# Altium schematic sheet [3] SCHEMATIC (new).SchDoc
size A3; SheetNumber: 1; SheetTotal: 1
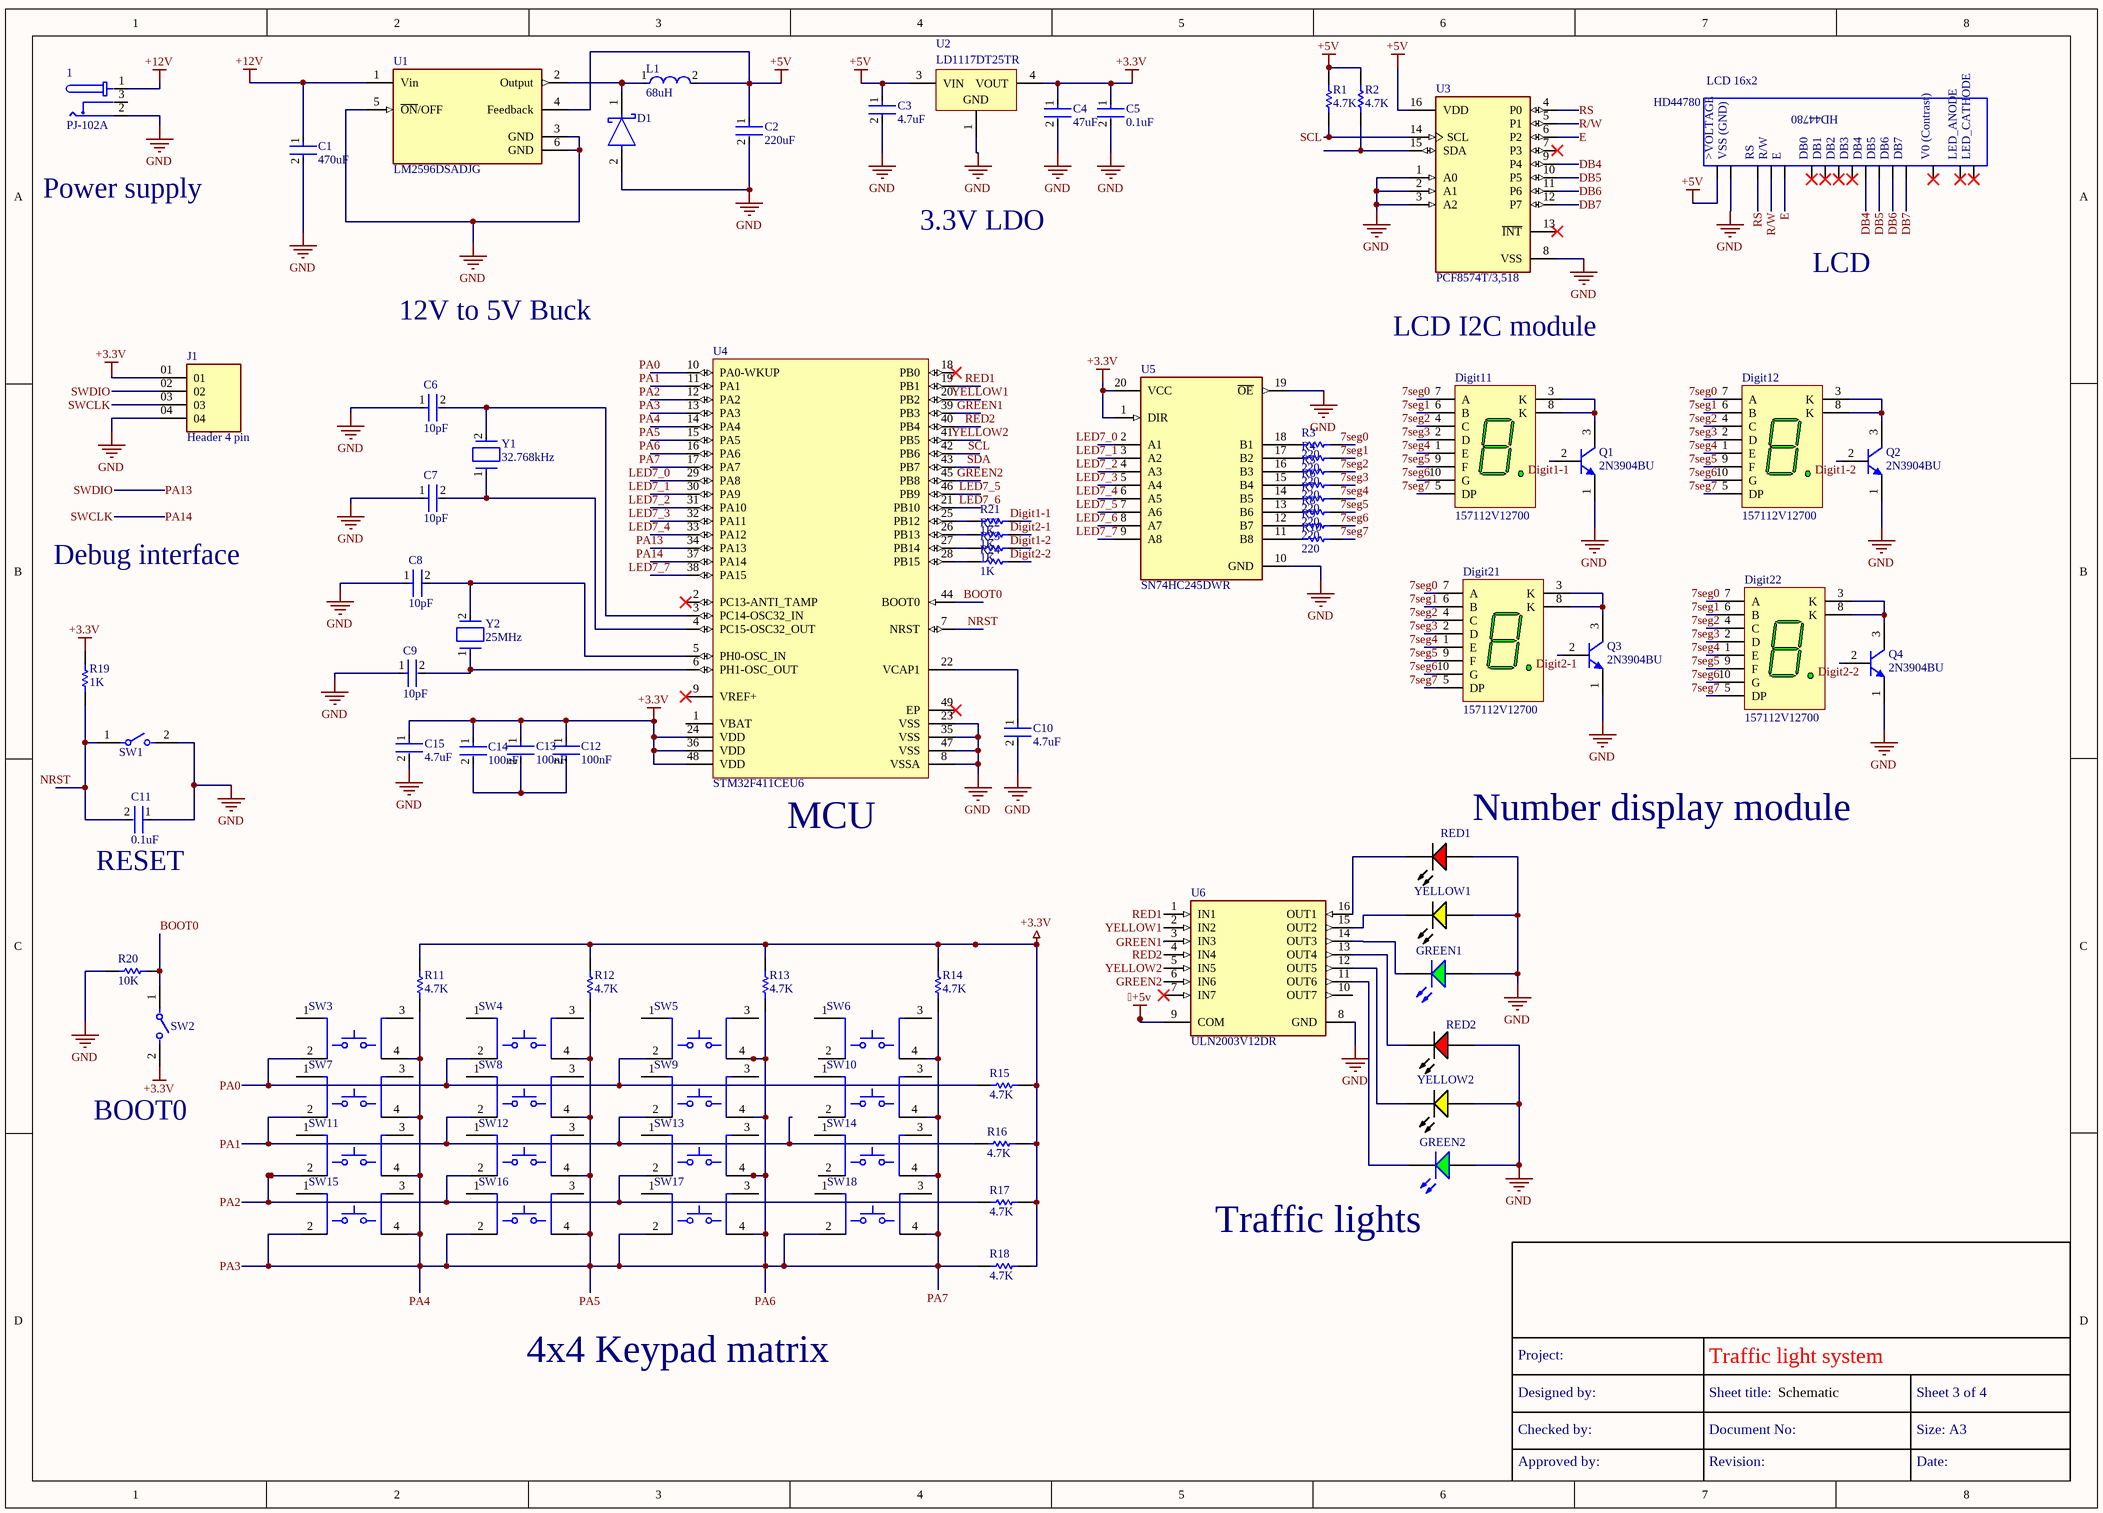
[diagram p0: [3] SCHEMATIC (new).SchDoc]

## Parts
1  PJ-102A  [CUI_PJ-102A]
C1  470uF  [FP-1206-L_3_2_0_2-W_1_6_0-IPC_A]
C2  220uF  [FP-CC1210-GD-IPC_C]
C3  4.7uF  [FP-1210-L_3_2_0_3-W_2_5_0-IPC_B]
C4  47uF  [FP-1206-L_3_2_0_2-W_1_6_0-IPC_A]
C5  0.1uF  [FP-C1206C-EB-MFG]
C6  10pF  [FP-C0603C-CF-IPC_B]
C7  10pF  [FP-C0603C-CF-IPC_B]
C8  10pF  [FP-C0603C-CF-IPC_B]
C9  10pF  [FP-C0603C-CF-IPC_B]
C10  4.7uF  [FP-1210-L_3_2_0_3-W_2_5_0-IPC_B]
C11  0.1uF  [FP-C1206C-EB-MFG]
C12  100nF  [FP-C1206C-EB-MFG]
C13  100nF  [FP-C1206C-EB-MFG]
C14  100nF  [FP-C1206C-EB-MFG]
C15  4.7uF  [FP-1210-L_3_2_0_3-W_2_5_0-IPC_B]
D1  1N5818-T  [FP-DO-41_Plastic-MFG]  (value not drawn)
Digit11  157112V12700  [WL-S7DS_L12W7.3H3.75]
Digit12  157112V12700  [WL-S7DS_L12W7.3H3.75]
Digit21  157112V12700  [WL-S7DS_L12W7.3H3.75]
Digit22  157112V12700  [WL-S7DS_L12W7.3H3.75]
GREEN1  WP7113SGD  [KING-WP7113SGD_V]  (value not drawn)
GREEN2  WP7113SGD  [KING-WP7113SGD_V]  (value not drawn)
J1  Header 4 pin  [SAMTEC_MTLW-104-X-X-S-X]
L1  68uH  [FP-LB2012-1_25-0_2-IPC_B]
LCD_16x2  HD44780  [16026-16X2]
Q1  2N3904BU  [FAIR-TO-92]
Q2  2N3904BU  [FAIR-TO-92]
Q3  2N3904BU  [FAIR-TO-92]
Q4  2N3904BU  [FAIR-TO-92]
R1  4.7K  [RESC1005X40X25NL05T05]
R2  4.7K  [RESC1005X40X25NL05T05]
R3  220  [RESC3225X60X45ML20T20]
R4  220  [RESC3225X60X45ML20T20]
R5  220  [RESC3225X60X45ML20T20]
R6  220  [RESC3225X60X45ML20T20]
R7  220  [RESC3225X60X45ML20T20]
R8  220  [RESC3225X60X45ML20T20]
R9  220  [RESC3225X60X45ML20T20]
R10  220  [RESC3225X60X45ML20T20]
R11  4.7K  [RESC1005X40X25NL05T05]
R12  4.7K  [RESC1005X40X25NL05T05]
R13  4.7K  [RESC1005X40X25NL05T05]
R14  4.7K  [RESC1005X40X25NL05T05]
R15  4.7K  [RESC1005X40X25NL05T05]
R16  4.7K  [RESC1005X40X25NL05T05]
R17  4.7K  [RESC1005X40X25NL05T05]
R18  4.7K  [RESC1005X40X25NL05T05]
R19  1K  [RESC0603X28X15ML05T05]
R20  10K  [RESC2013X60X30NL20T20]
R21  1K  [RESC0603X28X15ML05T05]
R22  1K  [RESC0603X28X15ML05T05]
R23  1K  [RESC0603X28X15ML05T05]
R24  1K  [RESC0603X28X15ML05T05]
RED1  WP7113SRD/D  [KING-WP7113SRDD_V]  (value not drawn)
RED2  WP7113SRD/D  [KING-WP7113SRDD_V]  (value not drawn)
SW1  CHS-01TA  [FP-CHS-01TA-MFG]  (value not drawn)
SW2  CHS-01TA  [FP-CHS-01TA-MFG]  (value not drawn)
SW3  SKQBARA010  [FP-SKQBARA010-MFG]  (value not drawn)
SW4  SKQBARA010  [FP-SKQBARA010-MFG]  (value not drawn)
SW5  SKQBARA010  [FP-SKQBARA010-MFG]  (value not drawn)
SW6  SKQBARA010  [FP-SKQBARA010-MFG]  (value not drawn)
SW7  SKQBARA010  [FP-SKQBARA010-MFG]  (value not drawn)
SW8  SKQBARA010  [FP-SKQBARA010-MFG]  (value not drawn)
SW9  SKQBARA010  [FP-SKQBARA010-MFG]  (value not drawn)
SW10  SKQBARA010  [FP-SKQBARA010-MFG]  (value not drawn)
SW11  SKQBARA010  [FP-SKQBARA010-MFG]  (value not drawn)
SW12  SKQBARA010  [FP-SKQBARA010-MFG]  (value not drawn)
SW13  SKQBARA010  [FP-SKQBARA010-MFG]  (value not drawn)
SW14  SKQBARA010  [FP-SKQBARA010-MFG]  (value not drawn)
SW15  SKQBARA010  [FP-SKQBARA010-MFG]  (value not drawn)
SW16  SKQBARA010  [FP-SKQBARA010-MFG]  (value not drawn)
SW17  SKQBARA010  [FP-SKQBARA010-MFG]  (value not drawn)
SW18  SKQBARA010  [FP-SKQBARA010-MFG]  (value not drawn)
U1  LM2596DSADJG  [FP-936A-02-MFG]
U2  LD1117DT25TR  [TO-252_L]
U3  PCF8574T/3,518  [FP-SOT162-1-MFG]
U4  STM32F411CEU6  [STM-UFQFPN48_L]
U5  SN74HC245DWR  [FP-DW0020A-MFG]
U6  ULN2003V12DR  [FP-D0016A-MFG]
Y1  32.768kHz  [FP-ABS09-MFG]
Y2  25MHz  [FP-7A-MFG]
YELLOW1  WP7113SYD  [KING-WP7113SYD_V]  (value not drawn)
YELLOW2  WP7113SYD  [KING-WP7113SYD_V]  (value not drawn)

## Nets
+5v: C4.1 C5.1 C12.1 C13.1 C14.1 C15.1 J1.01 R11.2 R12.2 R13.2 R14.2 R15.1 R16.1 R17.1 R18.1 R19.2 SW2.2 U2.4(VOUT) U4.24(VDD) U4.36(VDD) U4.48(VDD) U5.1(DIR) U5.20(VCC) U6.9(COM)  [also labelled +3.3V]
+5V: C2.1 C3.1 L1.2 LCD_16x2.P$2(VDD) R1.2 R2.2 U1.4(Feedback) U2.3(VIN) U3.16(VDD)
+12V: 1.1 C1.1 U1.1(Vin)
GND: 1.2 C1.2 C2.2 C3.2 C4.2 C5.2 C6.1 C7.1 C8.1 C9.1 C10.2 C11.1 C15.2 D1.2(A) GREEN1.1(A) GREEN2.1(A) J1.04 LCD_16x2.P$1(VSS) Q1.1(E) Q2.1(E) Q3.1(E) Q4.1(E) R20.1 RED1.1(A) RED2.1(A) SW1.2 U1.3(GND) U1.5(~{ON}/OFF) U1.6(GND) U2.1(GND) U3.1(A0) U3.2(A1) U3.3(A2) U3.8(VSS) U4.8(VSSA) U4.23(VSS) U4.35(VSS) U4.47(VSS) U5.10(GND) U5.19(~{OE}) U6.8(GND) YELLOW1.1(A) YELLOW2.1(A)
7seg0: Digit11.7(A) Digit12.7(A) Digit21.7(A) Digit22.7(A) R3.2
7seg1: Digit11.6(B) Digit12.6(B) Digit21.6(B) Digit22.6(B) R4.2
7seg2: Digit11.4(C) Digit12.4(C) Digit21.4(C) Digit22.4(C) R5.2
7seg3: Digit11.2(D) Digit12.2(D) Digit21.2(D) Digit22.2(D) R6.2
7seg4: Digit11.1(E) Digit12.1(E) Digit21.1(E) Digit22.1(E) R7.2
7seg5: Digit11.9(F) Digit12.9(F) Digit21.9(F) Digit22.9(F) R8.2
7seg6: Digit11.10(G) Digit12.10(G) Digit21.10(G) Digit22.10(G) R9.2
7seg7: Digit11.5(DP) Digit12.5(DP) Digit21.5(DP) Digit22.5(DP) R10.2
BOOT0: R20.2 SW2.1 U4.44(BOOT0)
DB4: LCD_16x2.P$11(DB4) U3.9(P4)
DB5: LCD_16x2.P$12(DB5) U3.10(P5)
DB6: LCD_16x2.P$13(DB6) U3.11(P6)
DB7: LCD_16x2.P$14(DB7) U3.12(P7)
Digit1-1: Q1.2(B) R21.2
Digit1-2: Q2.2(B) R23.2
Digit2-1: Q3.2(B) R22.2
Digit2-2: Q4.2(B) R24.2
E: LCD_16x2.P$6(E) U3.6(P2)
GREEN1: U4.39(PB3) U6.3(IN3)
GREEN2: U4.45(PB8) U6.6(IN6)
LED7_0: U4.29(PA8) U5.2(A1)
LED7_1: U4.30(PA9) U5.3(A2)
LED7_2: U4.31(PA10) U5.4(A3)
LED7_3: U4.32(PA11) U5.5(A4)
LED7_4: U4.33(PA12) U5.6(A5)
LED7_5: U4.46(PB9) U5.7(A6)
LED7_6: U4.21(PB10) U5.8(A7)
LED7_7: U4.38(PA15) U5.9(A8)
NRST: C11.2 R19.1 SW1.1 U4.7(NRST)
PA0: R15.2 SW3.2 SW4.2 SW5.2 U4.10(PA0-WKUP)
PA1: R16.2 SW7.2 SW8.2 SW9.2 U4.11(PA1)
PA2: R17.2 SW11.2 SW12.2 SW13.2 U4.12(PA2)
PA3: R11.1 R12.1 R13.1 R14.1 R18.2 SW3.4 SW4.4 SW5.4 SW6.4 SW7.4 SW8.4 SW9.4 SW10.4 SW11.4 SW12.4 SW13.4 SW14.4 SW15.2 SW15.4 SW16.2 SW16.4 SW17.2 SW17.4 SW18.2 SW18.4 U4.13(PA3) U4.14(PA4) U4.15(PA5) U4.16(PA6) U4.17(PA7)  [also labelled PA4, PA5, PA6, PA7]
PA13: J1.02 U4.34(PA13)  [also labelled SWDIO]
PA14: J1.03 U4.37(PA14)  [also labelled SWCLK]
R/W: LCD_16x2.P$5(R/W) U3.5(P1)
RED1: U4.19(PB1) U6.1(IN1)
RED2: U4.40(PB4) U6.4(IN4)
RS: LCD_16x2.P$4(RS) U3.4(P0)
SCL: R1.1 U3.14(SCL) U4.42(PB6)
SDA: U4.43(PB7)
YELLOW1: U4.20(PB2) U6.2(IN2)
YELLOW2: U4.41(PB5) U6.5(IN5)
NetC6_2: C6.2 U4.3(PC14-OSC32_IN) Y1.2
NetC7_2: C7.2 U4.4(PC15-OSC32_OUT) Y1.1
NetC8_2: C8.2 U4.5(PH0-OSC_IN) Y2.2
NetC9_2: C9.2 U4.6(PH1-OSC_OUT) Y2.1
NetC10_1: C10.1 U4.22(VCAP1)
NetC12_2: C12.2 C13.2 C14.2
NetD1_1: D1.1(C) L1.1 U1.2(Output)
NetDigit11_3: Digit11.3(K) Digit11.8(K) Q1.3(C)
NetDigit12_3: Digit12.3(K) Digit12.8(K) Q2.3(C)
NetDigit21_3: Digit21.3(K) Digit21.8(K) Q3.3(C)
NetDigit22_3: Digit22.3(K) Digit22.8(K) Q4.3(C)
NetGREEN1_2: GREEN1.2(K) U6.14(OUT3)
NetGREEN2_2: GREEN2.2(K) U6.11(OUT6)
NetR2_1: R2.1 U3.15(SDA)
NetR3_1: R3.1 U5.18(B1)
NetR4_1: R4.1 U5.17(B2)
NetR5_1: R5.1 U5.16(B3)
NetR6_1: R6.1 U5.15(B4)
NetR7_1: R7.1 U5.14(B5)
NetR8_1: R8.1 U5.13(B6)
NetR9_1: R9.1 U5.12(B7)
NetR10_1: R10.1 U5.11(B8)
NetR21_1: R21.1 U4.25(PB12)
NetR22_1: R22.1 U4.26(PB13)
NetR23_1: R23.1 U4.27(PB14)
NetR24_1: R24.1 U4.28(PB15)
NetRED1_2: RED1.2(K) U6.16(OUT1)
NetRED2_2: RED2.2(K) U6.13(OUT4)
NetU6_12: U6.12(OUT5) YELLOW2.2(K)
NetU6_15: U6.15(OUT2) YELLOW1.2(K)

Not connected (* = marked no-connect by the designer): 1 3; LCD_16x2 P$3(CONTRAST)* P$7(DB0)* P$8(DB1)* P$9(DB2)* P$10(DB3)* P$15(LED_A)* P$16(LED_C)*; SW3 1 3; SW4 1 3; SW5 1 3; SW6 1 2 3; SW7 1 3; SW8 1 3; SW9 1 3; SW10 1 2 3; SW11 1 3; SW12 1 3; SW13 1 3; SW14 1 2 3; SW15 1 3; SW16 1 3; SW17 1 3; SW18 1 3; U3 7(P3)* 13(~{INT})*; U4 1(VBAT) 2(PC13-ANTI_TAMP)* 9(VREF+)* 18(PB0)* 49(EP)*; U6 7(IN7)* 10(OUT7)

## Notes on the sheet
- Power supply
- 3.3V LDO
- LCD
- 12V to 5V Buck
- LCD I2C module
- Debug interface
- (near U4) MCU
- (near RED1) Number display module
- (near C11) RESET
- BOOT0
- (near GREEN2) Traffic lights
- 4x4 Keypad matrix
- Project:
- Designed by:
- Traffic light system
- Sheet title:
- Schematic
- Sheet 3 of 4
- Approved by:
- Checked by:
- Document No:
- Revision:
- Size: A3
- Date:
- (in symbol HD44780) >VOLTAGE; VSS (GND); V0 (Contrast); LED_ANODE; LED_CATHODE

## Library data of the parts
1 = PJ-102A: 2.0 x 6.5 mm, 2.5 A, Horizontal, Through Hole, Tapered Pins, Dc Power Jack Connector; MF: Same Sky; SnapEDA_Link: https://www.snapeda.com/parts/PJ-102A/Same+Sky/view-part/?ref=snap; Package: None; Value: *; MP: PJ-102A; Check_prices: https://www.snapeda.com/parts/PJ-102A/Same+Sky/view-part/?ref=eda
C1 = CMP-14477-001040-2: None; Capacitance: 47uF; Voltage Rating: 4V; Tolerance: 20%; Case Code (Imperial): 1206; RoHS Compliant: Yes; Max Operating Temperature: 125°C; Min Operating Temperature: -55°C; Case/Package: 1206; Packaging: Tape and Reel; Case Code (Metric): 3216; Mount: Surface Mount
C2 = CMP-03422-001480-1: CAP CER 220UF 6.3V X5R 1210; Tolerance: 20%; Capacitance: 220uF; Max Operating Temperature: 85°C; Mount: Surface Mount; RoHS Compliant: Yes; Packaging: Tape and Reel; Case/Package: 1210; Voltage Rating: 6.3V; Min Operating Temperature: -55°C
C3 C10 C15 = CMP-14477-002040-2: None
C4 = CMP-14477-001040-2: None; Voltage Rating: 4V; Tolerance: 20%; Capacitance: 47uF; Case Code (Imperial): 1206; RoHS Compliant: Yes; Max Operating Temperature: 125°C; Min Operating Temperature: -55°C; Case/Package: 1206; Packaging: Tape and Reel; Case Code (Metric): 3216; Mount: Surface Mount
C5 C11-C14 = CMP-03020-008411-1: C1206 0.10 μF U2J 2.00% 16 V; Manufacturer Part Number: C1206C104G4JACAUTO; Manufacturer: KEMET; Material: Ceramic; Temperature Coefficient: 15%; Tolerance: 0.02; Value: 0.10 μF; Automotive Grade: Grade 0; Voltage Rating: 16 V; Lead Free: Yes; RoHS: TRUE; Device Class L3: Ceramic Capacitors; Height: 0.88mm; ComponentLink2Description: Datasheet; Device Class L1: Passive Components; Package: C1206C-EB; Ipc Land Pattern Name: CAPC320160X78; Automotive: Yes; Category: Cap; Octopart: https://octopart.com/c1206c104g4jacauto-kemet-84732513; Temperature Range High: +150°C; Temperature: -55°C to +150°C; ComponentLink2URL: https://content.kemet.com/datasheets/KEM_C1007_X8R_ULTRA_150C_SMD.pdf; Device Class L2: Capacitors; Temperature Characteristic: U2J; Temperature Range Low: -55°C; Capacitance: 0.10 μF
C6-C9 = CMP-03020-007367-1: C0603 10 pF X8R 30ppm/°C 5.00% 25 V; Manufacturer Part Number: C0603C100J3HACTU; Manufacturer: KEMET; Automotive Grade: Grade 1; Tolerance: 0.05; Material: Ceramic; Voltage Rating: 25 V; Mouser Description: 10.0PF 25.0V Reel; Device Class L1: Passive Components; Package: C0603C-CF; Temperature Range High: +125°C; Temperature Range Low: -55°C; Octopart: https://octopart.com/c0603c100j3hactu-kemet-88724797; Temperature Characteristic: X8R; Lead Free: Yes; Height: 0.87mm; Device Class L2: Capacitors; Automotive: Yes; RoHS: TRUE; Capacitance: 10 pF; Value: 10 pF; Category: Cap; ComponentLink2URL: https://api.kemet.com/component-edge/download/datasheet/C0603C100J5GACAUTO.pdf; Temperature: -55°C to +125°C; Device Class L3: Ceramic Capacitors; ComponentLink2Description: Datasheet; Temperature Coefficient: 30ppm/°C
D1 = CMP-12790-000035-1: DIODE SCHOTTKY 30V 1A DO41; Manufacturer: Diodes Inc.; Value: 110pF; Max Junction Temp: +125°C; Peak Reverse Current: 1mA; Max Surge Forward Current: 25A; Max Repetitive Reverse Voltage: 30V; Reverse Voltage: 30V; Category: Diode; Automotive: No; Digikey Description: DIODE SCHOTTKY 30V 1A DO41; Forward Current: 1A; RoHS: TRUE; Lead Free: Yes; Temperature Range High: +125°C; ComponentLink2Description: Datasheet; Octopart: https://octopart.com/1n5818-t-diodes+inc.-55621749; Temperature: -65°C to +125°C; Temperature Range Low: -65°C; Manufacturer Part Number: 1N5818-T; Capacitance: 110pF; Mouser Description: Schottky Diodes & Rectifiers Vr/30V Io/1A T/R; Footprint Url: https://www.diodes.com/assets/Package-Files/DO-41-Plastic.pdf; Ipc Land Pattern Name: DIOAD1091W105L521D272; Device Class L3: Schottky Diodes; ComponentLink2URL: https://www.diodes.com/assets/Datasheets/ds23001.pdf; Height: 2.72mm; Package: DO-41 (Plastic); Device Class L2: Diodes; Device Class L1: Discrete Semiconductors
Digit11 Digit12 Digit21 Digit22 = CMP-03913-119893988-3: 7-Seg Display, Comm Cathode, Grn, 21Mcd Rohs Compliant: Yes |Wurth Elektronik 157112V12700; Dominant Wavelength: 570nm; Forward Voltage: 2V; Max Reverse Voltage (DC): 5V; Luminous Intensity: 12mcd; Forward Current: 100mA; Height: 3.75mm; Length: 12mm; RoHS: Compliant; Width: 7.3mm; Max Operating Temperature: 85°C; Min Operating Temperature: -35°C
GREEN1 GREEN2 = CMP-2100-03698-1: LED Green, 62.5 mW, 25 mA, -40 to 85 degC, 2-Pin THD, RoHS, Bulk; Manufacturer: Kingbright; Viewing Angle: 30degrees; Lens Style: Tinted; Test Current: 20mA; Forward Voltage: 2.2V; Wavelength: 568nm; Luminous Intensity: 40mcd; Package Reference: WP7113SGD; Colour: Green; Lead Free: LeadFree; Packaging: Bulk; RoHSCompliant: true; Package Quantity: 1000; Illumination Colour: Green; Case/Package: Radial; Datasheet URL: http://www.kingbrightusa.com/images/catalog/SPEC/WP7113SGD.pdf; Dominant Wavelength: 568nm; Datasheet Version: Rev. 6B, 01/2015; Package Description: 2-Pin Through Hole Device, Dia 5.9 mm, Body Length 8.6 mm; Height: 8.6mm
J1 = MTLW-104-X-X-S-X: MF: {'manufacturer': u'Samtec Inc.'}; Package: None; Price: None; Value: *; MP: MTLW-104-X-X-S-X; Availability: Unavailable
L1 = CMP-14484-000451-1: SMD Inductors 68uH ±10% 0.05A 7.8Ω 0805; Max DC Current: 50mA; Test Frequency: 2.52MHz; Core Material: Ferrite; Shielding: Unshielded; Self Resonant Frequency: 10MHz; DC Resistance (DCR): 6R; Termination: SMD/SMT; Lead Free: Lead Free; Radiation Hardening: No; Height: 1.25mm; Military Standard: Not; Min Operating Temperature: -40°C; Tolerance: 10%; Mount: Surface Mount; Packaging: Tape and Reel; Number of Pins: 2; Current Rating: 50mA; Case Code (Metric): 2012; Inductance: 68uH; Length: 0.079inch; Case/Package: 0805; Depth: 1.45mm; RoHS Compliant: Yes; Halogen Free: Halogen Free; Series: LB; Case Code (Imperial): 0805; Max Operating Temperature: 105°C; Height - Seated (Max): 0.057inch; Package Quantity: 1; DC Current: 50mA; Resistor Type: Wirewound; Width: 1.25mm
LCD_16x2 = HD44780: Character LCD Display Module Transflective 5 x 8 Dots STN - Super-Twisted Nematic LED - White Parallel 98.00mm x 60.00mm x 11.60mm; MF: Lumex Opto/Components; SnapEDA_Link: https://www.snapeda.com/parts/HD44780/Lumex%20Opto/Components%20Inc./view-part/44140/?ref=snap; Price: None; Availability: Unavailable; Package: None; MP: HD44780; Value: *
Q1-Q4 = CMP-2000-04944-1: NPN General-Purpose Amplifier, 40 V VCEO, 0.2 A, -55 to 150 degC, 2-Pin TO-92, RoHS, Bulk; Manufacturer: FairchildSemiconductor; Maximum Collector Base Voltage: 60V; Minimum DC Current Gain: 40@0.1mA@1V|70@1mA@1V|100@10mA@1V|60@50mA@1V|30@100mA@1V; Maximum Collector Emitter Voltage: 40V; Maximum DC Collector Current: 0.2A; Rad Hard: No; Maximum Operating Frequency: 300(Min)MHz; Maximum Collector Emitter Saturation Voltage: 0.2@1mA@10mA|0.3@5mA@50mAV; Maximum Power Dissipation: 625mW; Package Description: 3-Pin Transistor Outline Package, Body Dia 4.79 mm, Pitch 1.27 mm; Package Reference: TO-92; Pin Count: 3; Operating Temperature: -55to150degC; Category: GPBJT; Manufacturer URL: https://www.fairchildsemi.com/; Datasheet URL: https://datasheet.ciiva.com/4722/2n3904-82270-4722369.pdf; Package: 3TO-92; Packaging: Bulk; Type: NPN; Datasheet Version: Rev. 1.1.0, 10/2014; Mounting: ThroughHole
R1 R2 R11-R18 = CMP-1011-00090-2: Part Number: CRCW04024K70JNTD; Manufacturer: Vishay Dale
R3-R10 = CMP-2005-00232-1: Manufacturer: Vishay Dale; Part Number: CRCW1210220RJNEAHP
R19 R21-R24 = CMP-1010-00074-2: Manufacturer: Vishay Dale; Part Number: CRCW02011K00JNED
R20 = CMP-2001-02616-1: Manufacturer: KOA Speer; Part Number: SG73S2ATTD1002F
RED1 RED2 = CMP-1757-00002-1: The Super Bright Red Source Color Device, 1.85 V, -40 to 85 degC, 2-Pin THD, RoHS, Tape and Reel; Density: 1 MB; Min Supply Voltage: 1.71 V; Max Clock Frequency: 120 MHz; Max Supply Voltage: 3.6 V; Interface: UART; RAM Size: 128 KB; Case\Package: LQFP; Max Operating Temperature: 105 degC; Weight: 0.012224 oz; REACH SVHC: No SVHC; DatasheetVersion: Rev. 6A, 07/2016; Package Quantity: 160; Packaging: Tray; ComponentLink1Description: Datasheet; Min Operating Temperature: -40 degC; PackageDescription: 2-Pin Through Hole Device, Dia 5.9 mm, Body Length 8.6 mm; Pins: 64; PackageReference: WP7113SRDD; ComponentLink1URL: http://www.kingbrightusa.com/images/catalog/SPEC/WP7113SRD-D.pdf; RoHSCompliant: true
SW1 SW2 = CMP-71740-000003-1: SWITCH SLIDE DIP SPST 100MA 6V; Manufacturer: Nidec Copal Electronics; Contact Resistance: 50mΩ; Standoff Height: 0mm; Number Of Circuits: 1; Electromechanical Life: 2000Cycles; Device Class L1: Electromechanical; Device Class L2: Switches; Category: Switch; Temperature Range Low: -40°C; Device Class L3: DIP Switches; Height: 2.5mm; Lead Free: Yes; Octopart: https://octopart.com/chs-01ta-nidec+copal-52304644; Throw Configuration: SPST; Package: CHS-01TA; Voltage Rating Dc: 6V; Digikey Description: SWITCH SLIDE DIP SPST 100MA 6V; Mount: Surface Mount; Automotive: No; Contact Current Rating: 100mA; ComponentLink2URL: https://www.nidec-copal-electronics.com/e/catalog/switch/chs.pdf; ComponentLink2Description: Datasheet; Temperature: -40°C to +85°C; Temperature Range High: +85°C; RoHS: TRUE; Manufacturer Part Number: CHS-01TA
SW3-SW18 = CMP-00631-07849992-1: SKQBARA010 Switch Tactile N.O. SPST Round Button PC Pins 0.05A 12VDC 1.57N Thru-Hole Automotive; Life (Cycles): 100kcycles; Max Voltage Rating (DC): 12V; Contact Current Rating: 50mA; Contact Resistance: 500mΩ; Actuator Length: 850µm; Number of Positions: 2; Max Operating Temperature: 90°C; Throw Configuration: SPST; Contact Plating: Silver; Electrical Life: 100kcycles; RoHS: Compliant; Height: 5mm; Voltage Rating (DC): 12V; Termination: PC Pins; Orientation: Straight; Depth: 10.3mm; NexarPartId: 7849992; Packaging: Bulk; Color: Grey; Operating Force: 1.57N; Radiation Hardening: No; Schedule B: 8536509065, 8536509065|8536509065|8536509065|8536509065|8536509065; Current Rating: 50mA; Lead Free: Lead Free; Length: 10mm; Mount: Through Hole; Max Current Rating: 50mA; Min Operating Temperature: -40°C
U1 = CMP-07129-000001-1: IC REG MULT CONFG ADJ 3A D2PAK-5; Manufacturer: ON Semiconductor; Max Duty Cycle: 95%; Nominal Supply Current: 5mA; Standoff Height: 0mm; Min Supply Voltage: 4.5V; Output Voltage: 1.23-37V; Negative Voltage Available: true; Number Of Outputs: 1; Max Junction Temp: +125°C; Output Type: AdjustableProgrammable; Max Supply Voltage: 40V; Switching Topology: Boost,Buck,Buck-Boost; Switching Frequency: 150Hz; Output Current: 3A; Device Class L1: Integrated Circuits (ICs); Height: 4.826mm; Manufacturer Part Number: LM2596DSADJG; ComponentLink2URL: https://www.onsemi.com/pub/Collateral/LM2596-D.PDF; Device Class L3: Voltage Regulators - Switching; Octopart: https://octopart.com/lm2596dsadjg-on+semiconductor-12437034; Mouser Description: Voltage Regulators - Switching Regulators 3A BUCK SWCH 150KHZ; Automotive: No; RoHS: TRUE; Temperature Range High: +125°C; ComponentLink2Description: Datasheet; Device Class L2: Power Management ICs; Digikey Description: IC REG MULT CONFG ADJ 3A D2PAK-5; Temperature Range Low: -40°C; Footprint Url: https://www.onsemi.com/pub/Collateral/936A-02.PDF; Lead Free: Yes; Temperature: -40°C to +125°C; Package: 936A-02; Category: IC
U2 = CMP-0244-00090-1: Fixed Low Drop Positive Voltage Regulator, 3-Pin DPAK, Tape and Reel; DatasheetVersion: 1/11/2011; ComponentLink2Description: Datasheet; PackageVersion: 2011; PackageDescription: 3-Pin Transistor Outline Package 2.28 mm Pitch, 9.7 mm Lead Span (DPAK); PackageReference: TO-252; ComponentLink1URL: http://www.st.com; ComponentLink2URL: http://www.st.com/internet/com/TECHNICAL_RESOURCES/TECHNICAL_LITERATURE/DATASHEET/CD00000544.pdf; ComponentLink1Description: Manufacturer URL
U3 = CMP-10112-000010-1: IC I/O EXPANDER I2C 8B 16SOIC; Manufacturer: NXP Semiconductors; Frequency: 100kHz; Max Supply Voltage: 6V; Standoff Height: 0.1mm; Nominal Supply Current: 40uA; Max Junction Temp: +125°C; Min Supply Voltage: 2.5V; Number Of I/Os: 8; Manufacturer Part Number: PCF8574T/3,518; Footprint Url: https://www.nxp.com/docs/en/package-information/SOT162-1.pdf; ComponentLink2URL: https://www.nxp.com/docs/en/data-sheet/PCF8574_PCF8574A.pdf; Automotive: No; Digikey Description: IC I/O EXPANDER I2C 8B 16SOIC; Mouser Description: PCF8574 Series 2.5 - 6V Remote 8-bit I/O Expander for I2C-bus - SOIC-16; Ipc Land Pattern Name: SOIC127P1032X265-16; Interface: I2C; Octopart: https://octopart.com/pcf8574t%2F3%2C518-nxp+semiconductors-10470852; Ambient Temperature Range Low: -40°C; Lead Free: Yes; Device Class L2: Interface ICs; Temperature Range High: +85°C; Device Class L1: Integrated Circuits (ICs); Package: SOT162-1; ComponentLink2Description: Datasheet; Device Class L3: I/O Expanders; Temperature: -40°C to +85°C; Ambient Temperature Range High: +85°C; Height: 2.65mm; Category: IC; RoHS: TRUE; Temperature Range Low: -40°C
U4 = CMP-0243-00165-1: ARM Cortex-M4 32-bit MCU+FPU, 512 KB Flash, 128 KB RAM, 36 I/Os, 48-Pin UFQFPN, -40 to 85 degC, Tray; Operating Frequency(F) (Processor speed) (MHz): 100; FLASH Size (Prog) (kB): 512; Internal RAM Size (kB): 128; I/Os (High Current): 36; Supply Voltage(Vcc) min (V): 1.7; Package Reference: 48-Pin Ultra Thin Fine Pitch Quad Flat No-Lead, 7 x 7 x 0.6 mm Body, 0.5 mm Pitch, Exposed Pad; ComponentLink1Description: Manufacturer URL; ComponentLink1URL: http://www.st.com/; Packing: Tray; Package Description: UFQFPN48; Core: ARM Cortex-M4; ComponentLink2Description: Datasheet; ComponentLink2URL: http://www.st.com/st-web-ui/static/active/en/resource/technical/document/datasheet/DM00115249.pdf; DatasheetVersion: Rev. 6; Mounting Technology: Surface Mount
U5 = CMP-1620-00193-3: IC TRANSCVR NON-INVERT 6V 20SOIC; Logic Function: Transceiver; Number of Circuits: 8; High Level Output Current: -7.8mA; Min Supply Voltage: 2V; Direction: Bidirectional; Propagation Delay: 335ns; Number of Elements: 1; Operating Supply Voltage: 5V; Polarity: Non-Inverting; Quiescent Current: 8uA; Low Level Output Current: 7.8mA; Number of Channels: 8; Width: 7.52mm; Length: 12.8mm; Case/Package: SOIC; Lead Free: Lead Free; Max Supply Voltage: 6V; Max Operating Temperature: 85°C; Mount: Surface Mount; Weight: 0.017662oz; Height: 2.35mm; Contact Plating: Gold; Package Quantity: 1; RoHS Compliant: Yes; Min Operating Temperature: -40°C; Packaging: Tape and Reel; Number of Bits per Element: 8; Number of Outputs: 8; Number of Bits: 8; Number of Pins: 20; REACH SVHC: No SVHC; Turn-On Delay Time: 335ns; Radiation Hardening: No
U6 = CMP-04912-000075-1: MOSFET 7CH 16SOIC; Power Dissipation: 860mW; Output Current: 140mA; Collector Emitter Voltage (VCEO): 20V; Collector Emitter Saturation Voltage: 750mV; Output Voltage: 16V; Number of Drivers: 7; Number of Pins: 16; RoHS Compliant: Yes; Height: 1.5mm; Package Quantity: 1; REACH SVHC: No SVHC; Series: -; Min Operating Temperature: -40°C; Max Power Dissipation: 860mW; Max Collector Current: 140mA; Mount: Surface Mount; Packaging: Tape and Reel; Radiation Hardening: No; Case/Package: SOIC; Max Operating Temperature: 85°C; Number of Outputs: 7; Lead Free: Lead Free; Width: 4mm; Weight: 0.004998oz; Length: 10mm
Y1 = CMP-27762-005385-1: CRYSTAL 32.7680KHZ 12.5PF SMD; ESR (Equivalent Series Resistance): 70kR; Tolerance: 10ppm; Operating Frequency: 32.768 kHz; Package Quantity: 3000; Lead Free: Lead Free; Frequency: 32.768kHz; Load Capacitance: 12.5pF; Series Resistance: 70kR; Series: ABS09; Min Operating Temperature: -40°C; Frequency Tolerance: 10ppm; Packaging: Tape and Reel; Termination: SMD/SMT; RoHS Compliant: Yes; Width: 1.5mm; Number of Pins: 2; Case/Package: CSMD; Mount: Surface Mount; Height: 0.035inch; Length: 4.1mm; Depth: 1.5mm; Max Operating Temperature: 85°C
Y2 = CMP-18717-000353-1: Quartz Crystal 25MHz, 30ppm, 12pF, 50Ω; Series Resistance: 50R; Number of Pins: 2; Mount: Surface Mount; Height: 0.053inch; Max Operating Temperature: 85°C; Frequency: 25MHz; Min Operating Temperature: -40°C; Frequency Tolerance: 30ppm; Case/Package: SMD/SMT; Frequency Stability: 30ppm; Width: 0.126inch; Length: 0.197inch; Packaging: Tape and Reel; Series: 7A; Load Capacitance: 12pF; ESR (Equivalent Series Resistance): 50R; Package Quantity: 1000
YELLOW1 YELLOW2 = CMP-1757-00003-1: The Super Bright Yellow Device, 2 V, -40 to 85 degC, 2-Pin THD, RoHS, Tape and Reel; Tolerance: 1%; Power Rating: 250 mW; Voltage Rating: 250 V; Resistance: 22.1 kohm; Case\Package: Axial; Length: 0.248 inch; Max Operating Temperature: 155 degC; PackageDescription: 2-Pin Through Hole Device, Dia 5.9 mm, Body Length 8.6 mm; Package Quantity: 200; ComponentLink1Description: Datasheet; Mount: Through Hole; DatasheetVersion: Rev. 7B, 01/2015; RoHSCompliant: true; PackageReference: WP7113SYD; ComponentLink1URL: http://www.kingbrightusa.com/images/catalog/SPEC/WP7113SYD.pdf; Packaging: Bulk; Min Operating Temperature: -55 degC